# Altium schematic sheet 4G Modem.SchDoc: TITLE
size A3; DrawnBy: D Kleiss; Organization: Flinders University; Address1: College of Science & Engineering; Address2: Engineering Services Room 3.22; Address3: 1284 South Rd; Address4: SA 5042; DocumentNumber: A4; Revision: 1; SheetNumber: 1; SheetTotal: 1
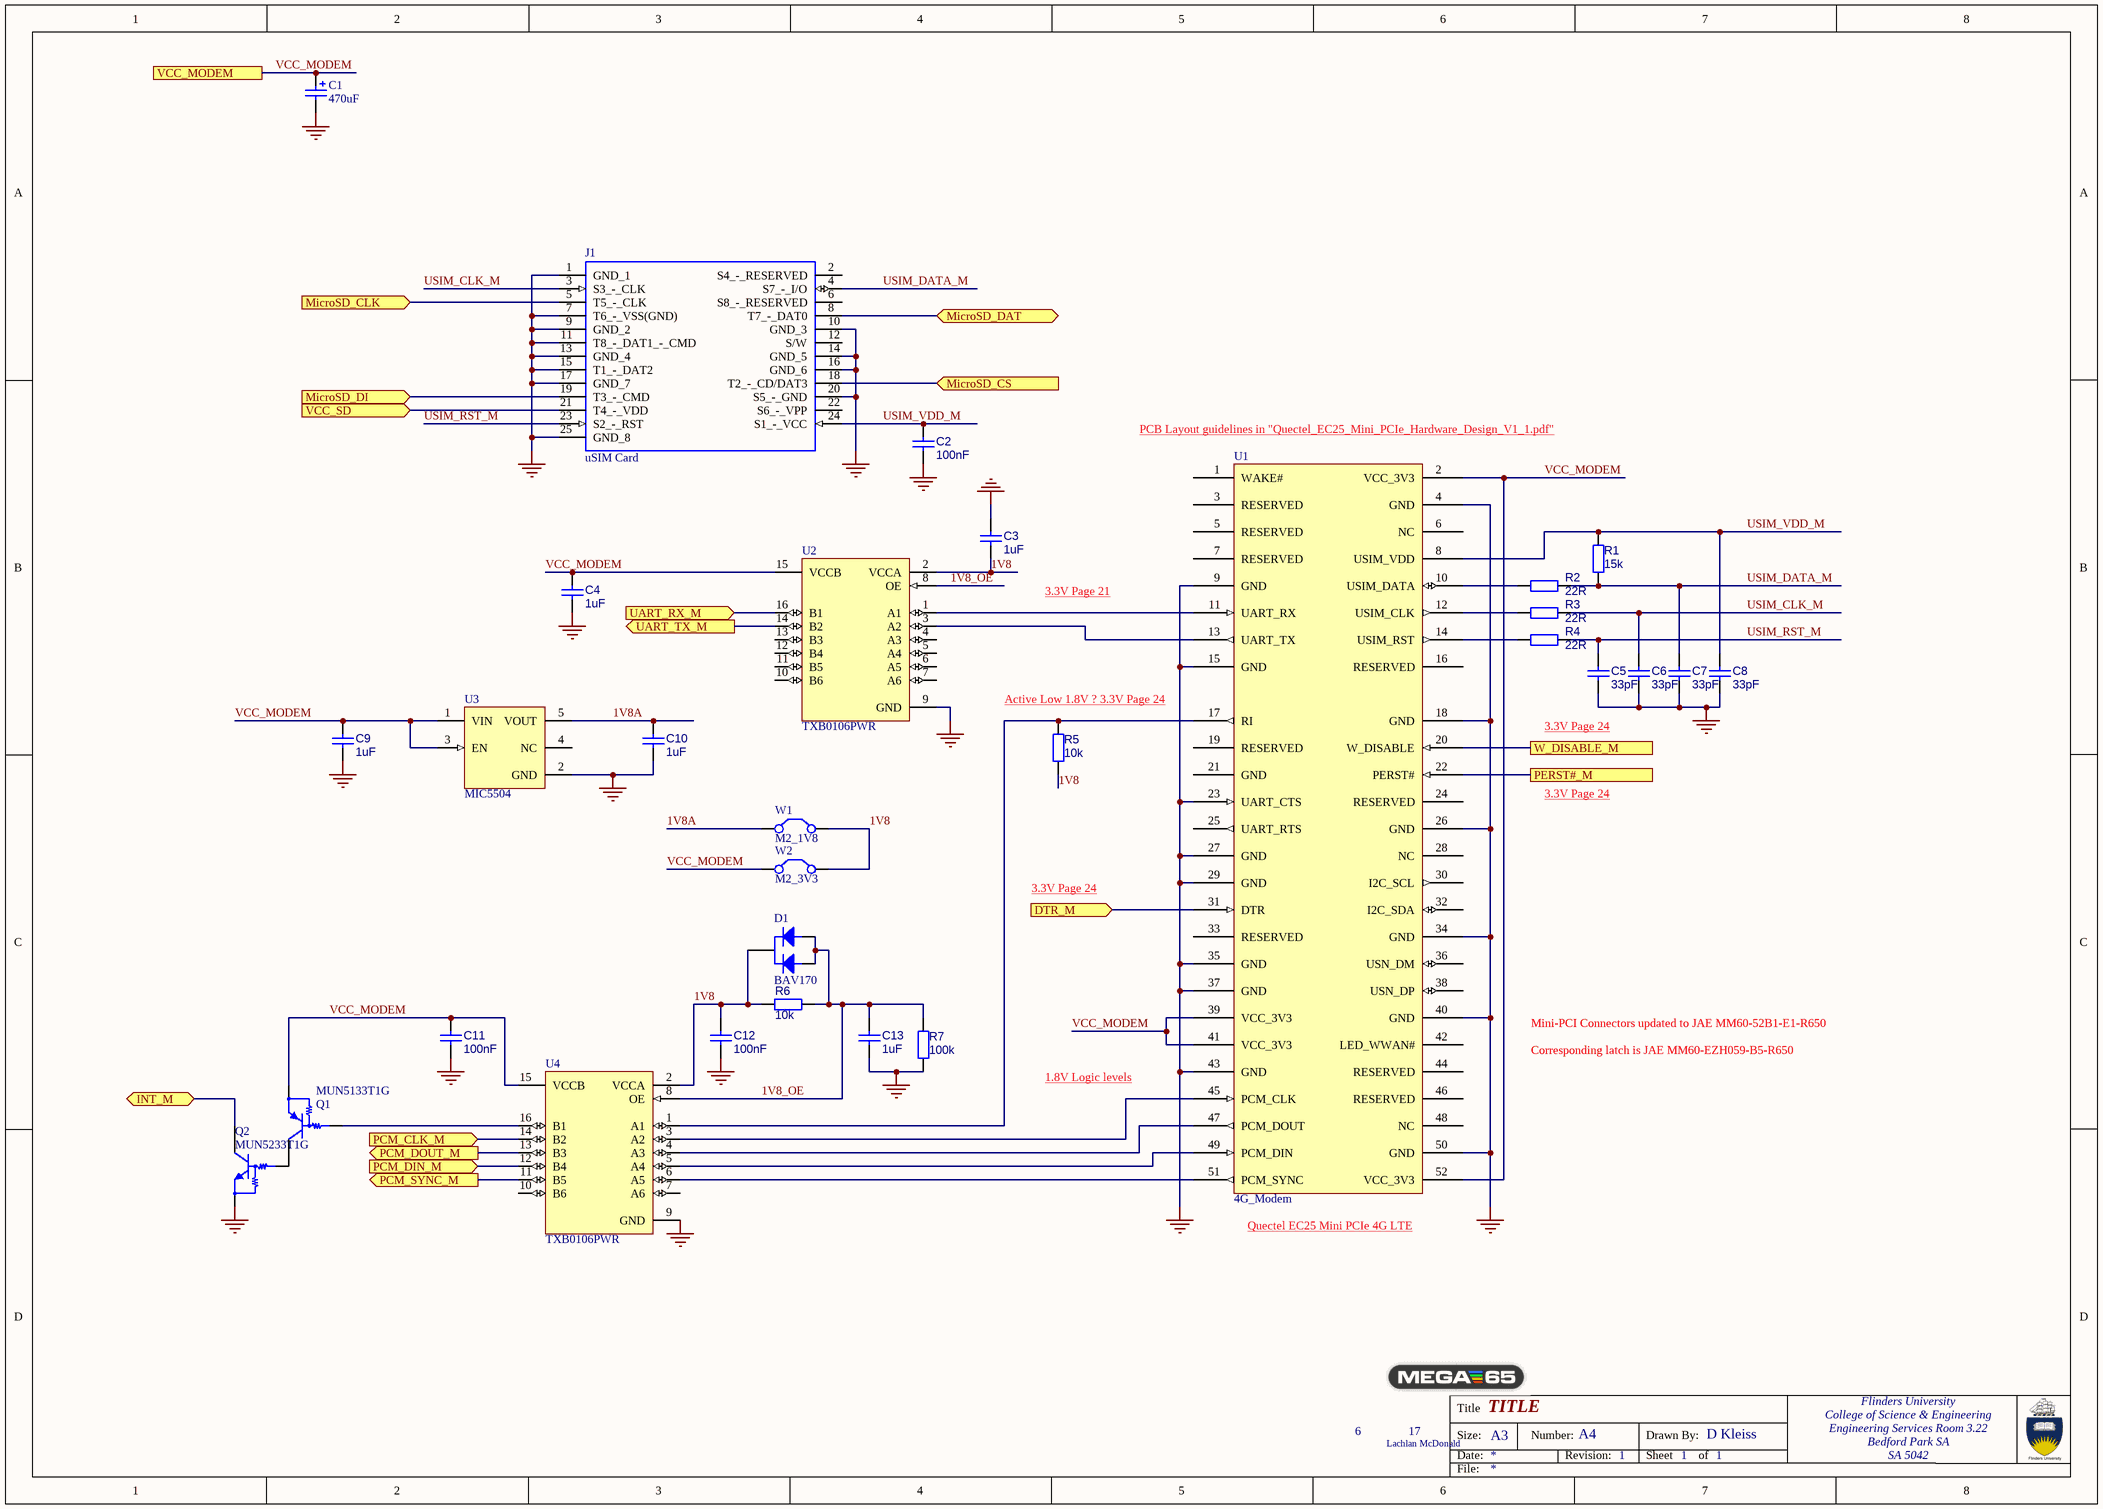
[diagram p0: 4G Modem.SchDoc]

## Parts
C1  470uF  [CAP Case D Tantalum]
C2  100nF  [0603_CAP UF HD]
C3  1uF  [0603_CAP UF HD]
C4  1uF  [0603_CAP UF HD]
C5  33pF  [0603_CAP PF HD]
C6  33pF  [0603_CAP PF HD]
C7  33pF  [0603_CAP PF HD]
C8  33pF  [0603_CAP PF HD]
C9  1uF  [0603_CAP UF HD]
C10  1uF  [0603_CAP UF HD]
C11  100nF  [0603_CAP UF HD]
C12  100nF  [0603_CAP UF HD]
C13  1uF  [0603_CAP UF HD]
D1  BAV170  [SOT-23]
J1  uSIM Card  [CONNECTOR MSIM MOLEX 1046421610]
Q1  MUN5133T1G  [SC70-3 (SOT-323)]
Q2  MUN5233T1G  [SC70-3 (SOT-323)]
R1  15k  [0603-RESISTOR HD]
R2  22R  [0603-RESISTOR HD]
R3  22R  [0603-RESISTOR HD]
R4  22R  [0603-RESISTOR HD]
R5  10k  [0603-RESISTOR HD]
R6  10k  [0603-RESISTOR HD]
R7  100k  [0603-RESISTOR HD]
U1  4G_Modem  [CONNECTOR MINI PCIE MOLEX_67910001]
U2  TXB0106PWR  [TSSOP-16]
U3  MIC5504  [SOT-23-5]
U4  TXB0106PWR  [TSSOP-16]
W1  M2_1V8  [0603-RESISTOR HD]
W2  M2_3V3  [0603-RESISTOR HD]

## Ports
DTR_M (in), INT_M (bidir), MicroSD_CLK (in), MicroSD_CS (in), MicroSD_DAT (bidir), MicroSD_DI (in), PCM_CLK_M (in), PCM_DIN_M (in), PCM_DOUT_M (out), PCM_SYNC_M (out), PERST#_M, UART_RX_M (in), UART_TX_M (out), VCC_MODEM, VCC_SD (in), W_DISABLE_M

## Nets
GND: C1.2 C2.2 C3.2 C4.2 C5.2 C6.2 C7.2 C8.2 C9.2 C10.2 C11.2 C12.2 C13.2 J1.1(GND_1) J1.7(T6_-_VSS(GND)) J1.9(GND_2) J1.10(GND_3) J1.11(T8_-_DAT1_-_CMD) J1.13(GND_4) J1.14(GND_5) J1.15(T1_-_DAT2) J1.16(GND_6) J1.17(GND_7) J1.20(S5_-_GND) J1.25(GND_8) Q2.1(E) R7.2 U1.4(GND) U1.9(GND) U1.15(GND) U1.18(GND) U1.23(UART_CTS) U1.26(GND) U1.27(GND) U1.29(GND) U1.34(GND) U1.35(GND) U1.37(GND) U1.40(GND) U1.43(GND) U1.50(GND) U2.9(GND) U3.2(GND) U4.9(GND)
1V8: C3.1 C12.1 D1.3(K) R5.1 R6.1 U2.2(VCCA) U4.2(VCCA) W1.2(C2) W2.2(C2)
1V8_OE: C13.1 D1.1(A1) D1.2(A2) R6.2 R7.1 U2.8(OE) U4.8(OE)
1V8A: C10.1 U3.5(VOUT) W1.1(C1)
DTR_M: U1.31(DTR) ; port DTR_M
INT_M: Q2.3(C) ; port INT_M
MicroSD_CLK: J1.5(T5_-_CLK) ; port MicroSD_CLK
MicroSD_CS: J1.18(T2_-_CD/DAT3) ; port MicroSD_CS
MicroSD_DAT: J1.8(T7_-_DAT0) ; port MicroSD_DAT
MicroSD_DI: J1.19(T3_-_CMD) ; port MicroSD_DI
PCM_CLK_M: U4.14(B2) ; port PCM_CLK_M
PCM_DIN_M: U4.12(B4) ; port PCM_DIN_M
PCM_DOUT_M: U4.13(B3) ; port PCM_DOUT_M
PCM_SYNC_M: U4.11(B5) ; port PCM_SYNC_M
PERST#_M: U1.22(PERST#) ; port PERST#_M
UART_RX_M: U2.16(B1) ; port UART_RX_M
UART_TX_M: U2.14(B2) ; port UART_TX_M
USIM_CLK_M: C6.1 J1.3(S3_-_CLK) R3.1
USIM_DATA_M: C7.1 J1.4(S7_-_I/O) R1.2 R2.1
USIM_RST_M: C5.1 J1.23(S2_-_RST) R4.1
USIM_VDD_M: C2.1 C8.1 J1.24(S1_-_VCC) R1.1 U1.8(USIM_VDD)
VCC_MODEM: C1.1 C4.1 C9.1 C11.1 Q1.2(E) U1.2(VCC_3V3) U1.39(VCC_3V3) U1.41(VCC_3V3) U1.52(VCC_3V3) U2.15(VCCB) U3.1(VIN) U3.3(EN) U4.15(VCCB) W2.1(C1) ; port VCC_MODEM
VCC_SD: J1.21(T4_-_VDD) ; port VCC_SD
W_DISABLE_M: U1.20(W_DISABLE) ; port W_DISABLE_M
NetQ1_1: Q1.1(B) U4.16(B1)
NetQ1_3: Q1.3(C) Q2.2(B)
NetR2_2: R2.2 U1.10(USIM_DATA)
NetR3_2: R3.2 U1.12(USIM_CLK)
NetR4_2: R4.2 U1.14(USIM_RST)
NetR5_2: R5.2 U1.17(RI) U4.1(A1)
NetU1_11: U1.11(UART_RX) U2.1(A1)
NetU1_13: U1.13(UART_TX) U2.3(A2)
NetU1_45: U1.45(PCM_CLK) U4.3(A2)
NetU1_47: U1.47(PCM_DOUT) U4.4(A3)
NetU1_49: U1.49(PCM_DIN) U4.5(A4)
NetU1_51: U1.51(PCM_SYNC) U4.6(A5)

Not connected (* = marked no-connect by the designer): J1 2(S4_-_RESERVED) 6(S8_-_RESERVED) 12(S/W) 22(S6_-_VPP); U1 1(WAKE#) 3(RESERVED) 5(RESERVED) 6(NC) 7(RESERVED) 16(RESERVED) 19(RESERVED) 21(GND) 24(RESERVED) 25(UART_RTS) 28(NC) 30(I2C_SCL) 32(I2C_SDA) 33(RESERVED) 36(USN_DM) 38(USN_DP) 42(LED_WWAN#) 44(RESERVED) 46(RESERVED) 48(NC); U2 4(A3) 5(A4) 6(A5) 7(A6) 10(B6) 11(B5) 12(B4) 13(B3); U3 4(NC); U4 7(A6) 10(B6)

## Notes on the sheet
- (near U1) PCB Layout guidelines in "Quectel_EC25_Mini_PCIe_Hardware_Design_V1_1.pdf"
- 3.3V Page 21
- (near R5) Active Low 1.8V ? 3.3V Page 24
- 3.3V Page 24
- Mini-PCI Connectors updated to JAE MM60-52B1-E1-R650
- Corresponding latch is JAE MM60-EZH059-B5-R650
- 1.8V Logic levels
- (near U1) Quectel EC25 Mini PCIe 4G LTE
- 6
- Lachlan McDonald
- 17
- Title
- Size:
- Date:
- A3
- Number:
- Revision:
- Sheet
- Drawn By:
- of
- Bedford Park SA
- File:

## Library data of the parts
C1 = Cap Pol: Polarized Capacitor (Radial); Manufacturer: AVX Corporation; Manufacturer Number: TPSD477K006R0060; Value: 470uF; Digikey Number: 478-11421-1-ND
C2 C5-C8 C11 C12 = Cap: Capacitor
  C2 C11 C12: Value: 100nF
  C5-C8: Value: 33pF
C3 C4 C9 C10 C13 = Cap: Capacitor; Manufacturer: Samsung; Manufacturer Number: CL10B105MO8NNWC; Value: 1uF; Digikey Number: 1276-6524-1-ND
D1 = BAV170: Dual Common Cathode Silicon Low Leakage Diode 3-Pin SOT-23; Manufacturer: Infineon Technologies; Manufacturer Number: BAV170E6327HTSA1; Digikey Number: BAV170E6327HTSA1CT-ND
J1 = 104642-1610: Molex 104642 Series 8 Way Micro SIM, MicroSD Memory Card Connector with Solder Termination; RS Part Number: 1213817P; Digikey Number: WM12958CT-ND; Manufacturer: Molex; Manufacturer Number: 104642-1610
Q1 = Transistor PNP Prebiased: PNP Bipolar Transistor, Prebiased; Manufacturer: ON Semiconductor; Manufacturer Number: MUN5133T1G; Digikey Number: MUN5133T1GOSCT-ND
Q2 = Transistor NPN Prebiased: NPN Bipolar Transistor, Prebiased; Manufacturer: ON Semiconductor; Manufacturer Number: MUN5233T1G; Digikey Number: MUN5233T1GOSCT-ND
R1-R7 = Resistor
  R1: Value: 15k
  R2-R4: Value: 22R
  R5 R6: Value: 10k
  R7: Value: 100k
U1 = 4G_Modem: Manufacturer: JAE; Manufacturer Number: MM60-52B1-E1-R650; Digikey Number: 670-2275-1-ND
U2 U4 = TXB0106PWR: 6-Bit Bidirectional Level-Shifting and Voltage Translator with Auto-Direction Sensing and +/- 15-kV ESD Protection, 1.2 to 3.6 V, -40 to 85 degC, 16-Pin TSSOP (PW), Green (RoHS & no Sb/Br), Tape and Reel; Manufacturer: Texas Instruments; Manufacturer Number: TXB0106PWR; Digikey Number: 296-23759-1-ND
U3 = MIC5504: 300 mA Single Output LDO in Small Packages; Manufacturer: Microchip; Manufacturer Number: MIC5504-1.8YM5-TR; Digikey Number: 576-4879-1-ND
W1 W2 = Jumper: Jumper Wire; Published: 24-Mar-1999; LatestRevisionDate: 17-Jul-2002; LatestRevisionNote: Re-released for DXP Platform.; PackageReference: RAD-0.2; Publisher: Altium Limited; PackageDescription: Radial Cap, Thru-Hole; 2 Leads; 0.2 in Pin Spacing